# Altium schematic sheet Part03_MT7688_Peripheral.SchDoc
size A4
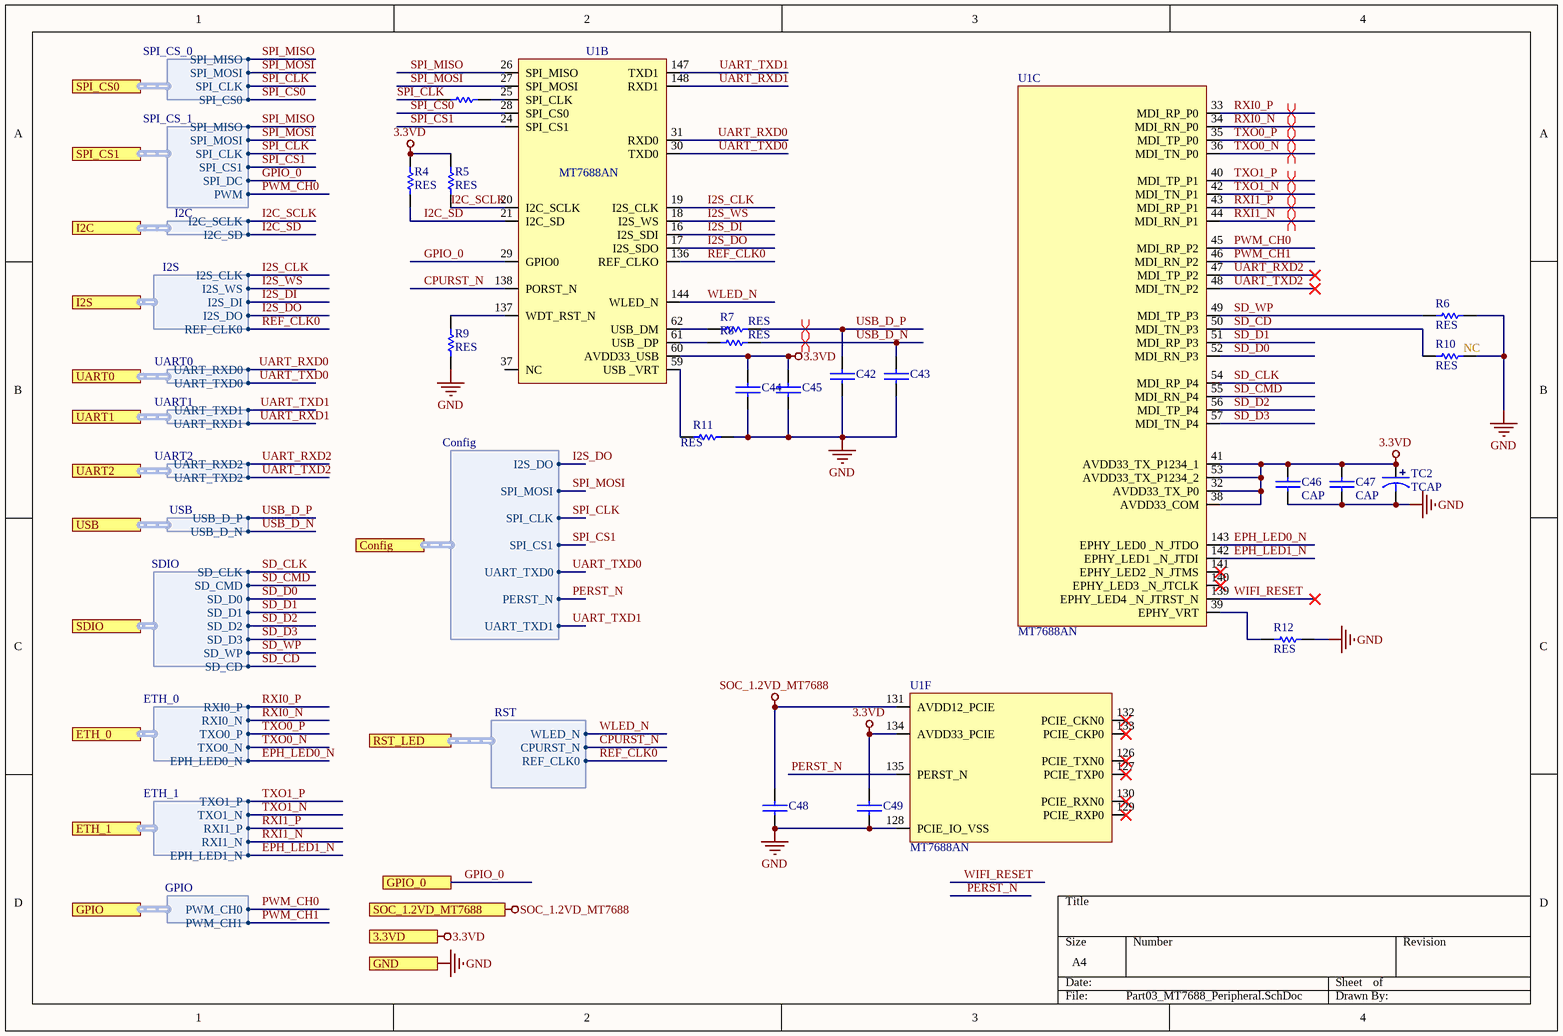
[diagram p0: Part03_MT7688_Peripheral.SchDoc]

## Parts
C42  CAP  [0402C]  (value not drawn)
C43  CAP  [0402C]  (value not drawn)
C44  CAP  [0402C]  (value not drawn)
C45  CAP  [0402C]  (value not drawn)
C46  CAP  [0402C]
C47  CAP  [0402C]
C48  CAP  [0402C]  (value not drawn)
C49  CAP  [0402C]  (value not drawn)
R3  RES  [0402R]  (value not drawn)
R4  RES  [0402R]
R5  RES  [0402R]
R6  RES  [0402R]
R7  RES  [0402R]
R8  RES  [0402R]
R9  RES  [0402R]
R10  RES  [0402R]
R11  RES  [0402R]
R12  RES  [0402R]
TC2  TCAP  [TAJ-A/3216]
U1  MT7688AN  [MT7628AN$2F$DRQFN156$2F$SMD$2F$P0.5$2F$12X12]  (parts B,C,F of 6)

## Ports
3.3VD, Config (harness Config), ETH_0 (harness ETH_0), ETH_1 (harness ETH_1), GND, GPIO (harness GPIO), GPIO_0, I2C (harness I2C), I2S (harness I2S), RST_LED (harness RST), SDIO (harness SDIO), SOC_1.2VD_MT7688, SPI_CS0 (harness SPI_CS_0), SPI_CS1 (harness SPI_CS_1), UART0 (harness UART0), UART1 (harness UART1), UART2 (harness UART2), USB (harness USB)

## Harnesses
SPI_CS_1: SPI_MISO, SPI_MOSI, SPI_CLK, SPI_CS1, SPI_DC, PWM
SPI_CS_0: SPI_MISO, SPI_MOSI, SPI_CLK, SPI_CS0
I2C: I2C_SCLK, I2C_SD
I2S: I2S_CLK, I2S_WS, I2S_DI, I2S_DO, REF_CLK0
UART0: UART_RXD0, UART_TXD0
UART1: UART_TXD1, UART_RXD1
UART2: UART_RXD2, UART_TXD2
USB: USB_D_P, USB_D_N
SDIO: SD_CLK, SD_CMD, SD_D0, SD_D1, SD_D2, SD_D3, SD_WP, SD_CD
ETH_0: RXI0_P, RXI0_N, TXO0_P, TXO0_N, EPH_LED0_N
ETH_1: TXO1_P, TXO1_N, RXI1_P, RXI1_N, EPH_LED1_N
GPIO: PWM_CH0, PWM_CH1
Config: I2S_DO, SPI_MOSI, SPI_CLK, SPI_CS1, UART_TXD0, PERST_N, UART_TXD1
RST: WLED_N, CPURST_N, REF_CLK0

## Nets
3.3VD: C44.1 C45.1 C46.1 C47.1 C49.1 R4.2 R5.2 TC2.1 U1.32(AVDD33_TX_P0) U1.38(AVDD33_COM) U1.41(AVDD33_TX_P1234_1) U1.53(AVDD33_TX_P1234_2) U1.60(AVDD33_USB) U1.134(AVDD33_PCIE) ; port 3.3VD
GND: C42.2 C43.2 C44.2 C45.2 C46.2 C47.2 C48.2 C49.2 R6.1 R9.1 R10.1 R11.1 R12.1 TC2.2 U1.128(PCIE_IO_VSS) ; port GND
SOC_1.2VD_MT7688: C48.1 U1.131(AVDD12_PCIE) ; port SOC_1.2VD_MT7688
CPURST_N: U1.138(PORST_N) ; port RST_LED.CPURST_N
EPH_LED0_N: U1.143(EPHY_LED0__N_JTDO) ; port ETH_0.EPH_LED0_N
EPH_LED1_N: U1.142(EPHY_LED1__N_JTDI) ; port ETH_1.EPH_LED1_N
GPIO_0: U1.29(GPIO0) ; port GPIO_0, port SPI_CS1.SPI_DC
I2C_SCLK: R5.1 U1.20(I2C_SCLK) ; port I2C.I2C_SCLK
I2C_SD: R4.1 U1.21(I2C_SD) ; port I2C.I2C_SD
I2S_CLK: U1.19(I2S_CLK) ; port I2S.I2S_CLK
I2S_DI: U1.16(I2S_SDI) ; port I2S.I2S_DI
I2S_DO: U1.17(I2S_SDO) ; port I2S.I2S_DO, port Config.I2S_DO
I2S_WS: U1.18(I2S_WS) ; port I2S.I2S_WS
PERST_N: U1.135(PERST_N) ; port Config.PERST_N
PWM_CH0: U1.45(MDI_RP_P2) ; port SPI_CS1.PWM, port GPIO.PWM_CH0
PWM_CH1: U1.46(MDI_RN_P2) ; port GPIO.PWM_CH1
REF_CLK0: U1.136(REF_CLKO) ; port I2S.REF_CLK0, port RST_LED.REF_CLK0
RXI0_N: U1.34(MDI_RN_P0) ; port ETH_0.RXI0_N
RXI0_P: U1.33(MDI_RP_P0) ; port ETH_0.RXI0_P
RXI1_N: U1.44(MDI_RN_P1) ; port ETH_1.RXI1_N
RXI1_P: U1.43(MDI_RP_P1) ; port ETH_1.RXI1_P
SD_CD: R10.2 U1.50(MDI_TN_P3) ; port SDIO.SD_CD
SD_CLK: U1.54(MDI_RP_P4) ; port SDIO.SD_CLK
SD_CMD: U1.55(MDI_RN_P4) ; port SDIO.SD_CMD
SD_D0: U1.52(MDI_RN_P3) ; port SDIO.SD_D0
SD_D1: U1.51(MDI_RP_P3) ; port SDIO.SD_D1
SD_D2: U1.56(MDI_TP_P4) ; port SDIO.SD_D2
SD_D3: U1.57(MDI_TN_P4) ; port SDIO.SD_D3
SD_WP: R6.2 U1.49(MDI_TP_P3) ; port SDIO.SD_WP
SPI_CLK: R3.2 ; port SPI_CS1.SPI_CLK, port SPI_CS0.SPI_CLK, port Config.SPI_CLK
SPI_CS0: U1.28(SPI_CS0) ; port SPI_CS0.SPI_CS0
SPI_CS1: U1.24(SPI_CS1) ; port SPI_CS1.SPI_CS1, port Config.SPI_CS1
SPI_MISO: U1.26(SPI_MISO) ; port SPI_CS1.SPI_MISO, port SPI_CS0.SPI_MISO
SPI_MOSI: U1.27(SPI_MOSI) ; port SPI_CS1.SPI_MOSI, port SPI_CS0.SPI_MOSI, port Config.SPI_MOSI
TXO0_N: U1.36(MDI_TN_P0) ; port ETH_0.TXO0_N
TXO0_P: U1.35(MDI_TP_P0) ; port ETH_0.TXO0_P
TXO1_N: U1.42(MDI_TN_P1) ; port ETH_1.TXO1_N
TXO1_P: U1.40(MDI_TP_P1) ; port ETH_1.TXO1_P
UART_RXD0: U1.31(RXD0) ; port UART0.UART_RXD0
UART_RXD1: U1.148(RXD1) ; port UART1.UART_RXD1
UART_RXD2: U1.47(MDI_TP_P2) ; port UART2.UART_RXD2
UART_TXD0: U1.30(TXD0) ; port UART0.UART_TXD0, port Config.UART_TXD0
UART_TXD1: U1.147(TXD1) ; port UART1.UART_TXD1, port Config.UART_TXD1
UART_TXD2: U1.48(MDI_TN_P2) ; port UART2.UART_TXD2
USB_D_N: C43.1 R8.1 ; port USB.USB_D_N
USB_D_P: C42.1 R7.1 ; port USB.USB_D_P
WIFI_RESET: U1.139(EPHY_LED4__N_JTRST_N)
WLED_N: U1.144(WLED_N) ; port RST_LED.WLED_N
NetR3_1: R3.1 U1.25(SPI_CLK)
NetR7_2: R7.2 U1.62(USB_DM)
NetR8_2: R8.2 U1.61(USB__DP)
NetR9_2: R9.2 U1.137(WDT_RST_N)
NetR11_2: R11.2 U1.59(USB__VRT)
NetR12_2: R12.2 U1.39(EPHY_VRT)

Not connected (* = marked no-connect by the designer): U1 37(NC) 126(PCIE_TXN0)* 127(PCIE_TXP0)* 129(PCIE_RXP0)* 130(PCIE_RXN0)* 132(PCIE_CKN0)* 133(PCIE_CKP0)* 140(EPHY_LED3__N_JTCLK)* 141(EPHY_LED2__N_JTMS)*

## Layout directives
differential pair: RXI0_N, RXI0_P, RXI1_N, RXI1_P, TXO0_N, TXO0_P, TXO1_N, TXO1_P, USB_D_N, USB_D_P

## Notes on the sheet
- (near R10) NC

## Library data of the parts
C42-C49 = CAP: 无极性电容
TC2 = TCAP: 钽电容